# Altium project bms.PrjPcb
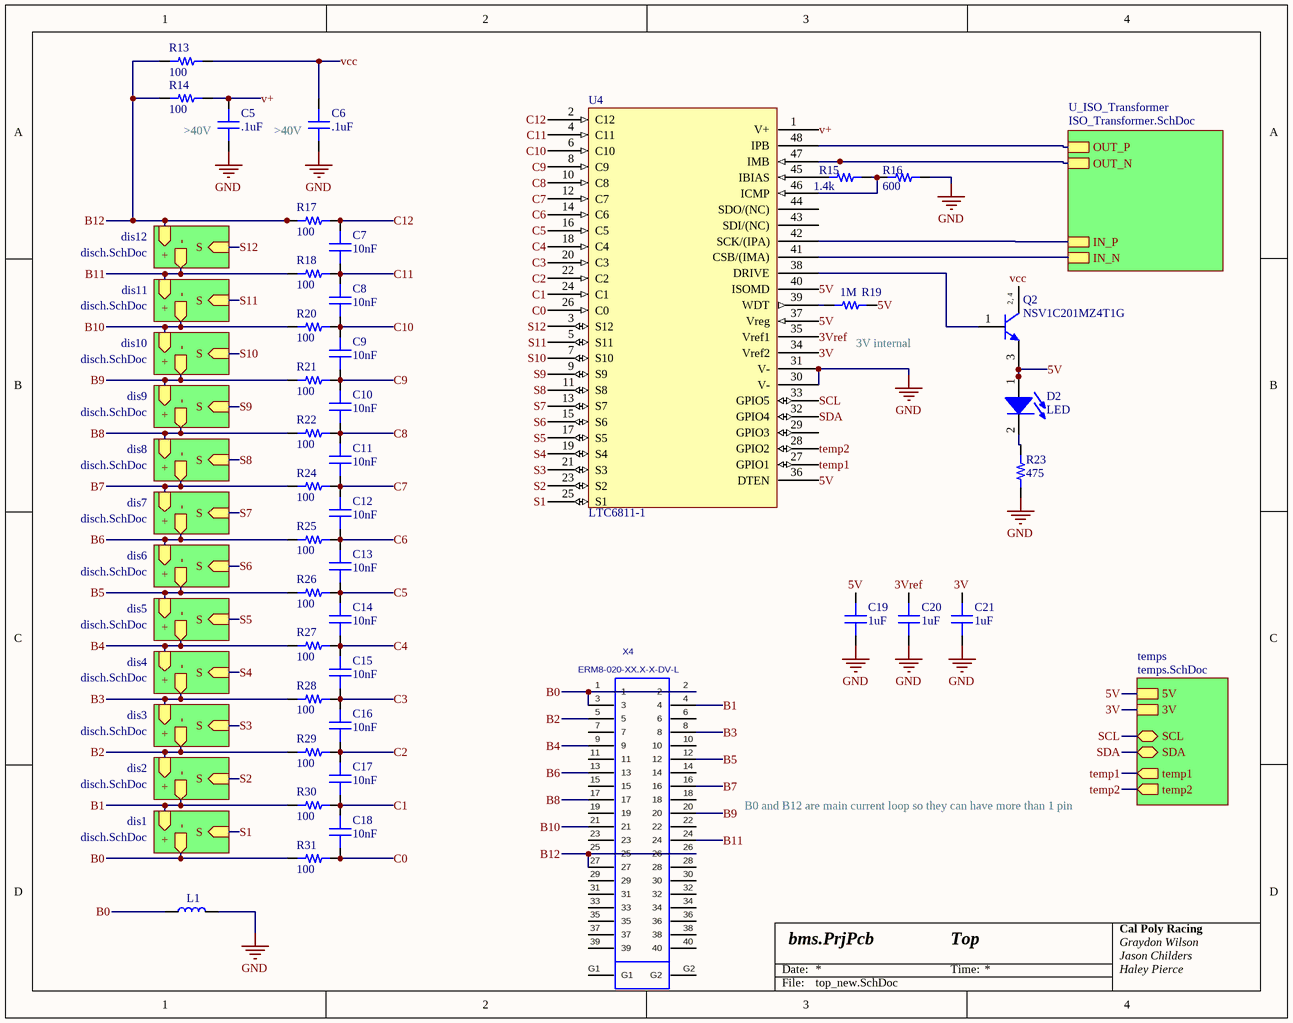
[diagram p0: top_new.SchDoc]
4 sheets, 122 parts. Net scope: hierarchical (ports join the sheet entries above them; power ports are global).
Board file: BMS.PcbDoc
Sheets:
  top_new.SchDoc
    dis1 = disch.SchDoc
    dis2 = disch.SchDoc
    dis3 = disch.SchDoc
    dis4 = disch.SchDoc
    dis5 = disch.SchDoc
    dis6 = disch.SchDoc
    dis7 = disch.SchDoc
    dis8 = disch.SchDoc
    dis9 = disch.SchDoc
    dis10 = disch.SchDoc
    dis11 = disch.SchDoc
    dis12 = disch.SchDoc
    U_ISO_Transformer = ISO_Transformer.SchDoc
    temps = temps.SchDoc

## Sheet top_new.SchDoc: Top
size A; Organization: Cal Poly Racing; engineer1: Graydon Wilson; engineer2: Jason Childers; engineer3: Haley Pierce

### Parts
(Parts that share a designator on the sheet are numbered #1, #2 ... from top to bottom, then left to right.)
C5  capacitance: .1uF  [0603]  (hidden comment: capacitor)
C6  capacitance: .1uF  [0603]  (hidden comment: capacitor)
C7  capacitance: 10nF  [0603]  (hidden comment: capacitor)
C8  capacitance: 10nF  [0603]  (hidden comment: capacitor)
C9  capacitance: 10nF  [0603]  (hidden comment: capacitor)
C10  capacitance: 10nF  [0603]  (hidden comment: capacitor)
C11  capacitance: 10nF  [0603]  (hidden comment: capacitor)
C12  capacitance: 10nF  [0603]  (hidden comment: capacitor)
C13  capacitance: 10nF  [0603]  (hidden comment: capacitor)
C14  capacitance: 10nF  [0603]  (hidden comment: capacitor)
C15  capacitance: 10nF  [0603]  (hidden comment: capacitor)
C16  capacitance: 10nF  [0603]  (hidden comment: capacitor)
C17  capacitance: 10nF  [0603]  (hidden comment: capacitor)
C18  capacitance: 10nF  [0603]  (hidden comment: capacitor)
C19  capacitance: 1uF  [0603]  (hidden comment: capacitor)
C20  capacitance: 1uF  [0603]  (hidden comment: capacitor)
C21  capacitance: 1uF  [0603]  (hidden comment: capacitor)
D2#1  LED  [0805_LED]
L1  MPZ1608S221ATA00  [0603]  (value not drawn)
Q2#1  NSV1C201MZ4T1G  [ONSC-SOT-223-4-318E-04_V]
R13  100  [RES 0805/2012]
R14  100  [RES 0805/2012]
R15#1  1.4k  [RES 0603/1608]
R16  600  [RES 0603/1608]
R17#1  100  [RES 0603/1608]
R18  100  [RES 0603/1608]
R19#1  1M  [RES 0603/1608]
R20  100  [RES 0603/1608]
R21#1  100  [RES 0603/1608]
R22  100  [RES 0603/1608]
R23#1  475  [RES 0805/2012]
R24  100  [RES 0603/1608]
R25#1  100  [RES 0603/1608]
R26  100  [RES 0603/1608]
R27#1  100  [RES 0603/1608]
R28  100  [RES 0603/1608]
R29#1  100  [RES 0603/1608]
R30  100  [RES 0603/1608]
R31#1  100  [RES 0603/1608]
U4  LTC6811-1  [LTC6811-1]
X4  ERM8-020-XX.X-X-DV-L  [ERM8-020-XX.X-X-DV-L]

### Sub-sheets
dis1 = disch.SchDoc: - (out), + (in), S (in)
dis2 = disch.SchDoc: - (out), + (in), S (in)
dis3 = disch.SchDoc: - (out), + (in), S (in)
dis4 = disch.SchDoc: - (out), + (in), S (in)
dis5 = disch.SchDoc: - (out), + (in), S (in)
dis6 = disch.SchDoc: - (out), + (in), S (in)
dis7 = disch.SchDoc: - (out), + (in), S (in)
dis8 = disch.SchDoc: - (out), + (in), S (in)
dis9 = disch.SchDoc: - (out), + (in), S (in)
dis10 = disch.SchDoc: - (out), + (in), S (in)
dis11 = disch.SchDoc: - (out), + (in), S (in)
dis12 = disch.SchDoc: - (out), + (in), S (in)
temps = temps.SchDoc: 5V, SCL (bidir), SDA (bidir), temp1 (out), temp2 (out), 3V
U_ISO_Transformer = ISO_Transformer.SchDoc: OUT_P, OUT_N, IN_P, IN_N

### Nets
GND: C5.1 C6.1 C19.1 C20.1 C21.1 L1.2 R16.2 R23#1.1 U4.30(V-) U4.31(V-)
3V: C21.2 U4.34(Vref2) ; sheet temps/3V
3Vref: C20.2 U4.35(Vref1)
5V: C19.2 D2#1.1(A) Q2#1.3(E) R19#1.2 U4.36(DTEN) U4.37(Vreg) U4.40(ISOMD) ; sheet temps/5V
B0: L1.1 R31#1.1 X4.1 X4.2 X4.3 ; sheet dis1/-
B1: R30.1 X4.4 ; sheet dis1/+, sheet dis2/-
B2: R29#1.1 X4.5 ; sheet dis2/+, sheet dis3/-
B3: R28.1 X4.8 ; sheet dis3/+, sheet dis4/-
B4: R27#1.1 X4.9 ; sheet dis4/+, sheet dis5/-
B5: R26.1 X4.12 ; sheet dis5/+, sheet dis6/-
B6: R25#1.1 X4.13 ; sheet dis6/+, sheet dis7/-
B7: R24.1 X4.16 ; sheet dis7/+, sheet dis8/-
B8: R22.1 X4.17 ; sheet dis8/+, sheet dis9/-
B9: R21#1.1 X4.20 ; sheet dis9/+, sheet dis10/-
B10: R20.1 X4.21 ; sheet dis10/+, sheet dis11/-
B11: R18.1 X4.24 ; sheet dis11/+, sheet dis12/-
B12: R13.1 R14.1 R17#1.1 X4.25 X4.26 X4.27 ; sheet dis12/+
C0: C18.1 R31#1.2 U4.26(C0)
C1: C17.1 C18.2 R30.2 U4.24(C1)
C2: C16.1 C17.2 R29#1.2 U4.22(C2)
C3: C15.1 C16.2 R28.2 U4.20(C3)
C4: C14.1 C15.2 R27#1.2 U4.18(C4)
C5: C13.1 C14.2 R26.2 U4.16(C5)
C6: C12.1 C13.2 R25#1.2 U4.14(C6)
C7: C11.1 C12.2 R24.2 U4.12(C7)
C8: C10.1 C11.2 R22.2 U4.10(C8)
C9: C9.1 C10.2 R21#1.2 U4.8(C9)
C10: C8.1 C9.2 R20.2 U4.6(C10)
C11: C7.1 C8.2 R18.2 U4.4(C11)
C12: C7.2 R17#1.2 U4.2(C12)
S1: U4.25(S1) ; sheet dis1/S
S2: U4.23(S2) ; sheet dis2/S
S3: U4.21(S3) ; sheet dis3/S
S4: U4.19(S4) ; sheet dis4/S
S5: U4.17(S5) ; sheet dis5/S
S6: U4.15(S6) ; sheet dis6/S
S7: U4.13(S7) ; sheet dis7/S
S8: U4.11(S8) ; sheet dis8/S
S9: U4.9(S9) ; sheet dis9/S
S10: U4.7(S10) ; sheet dis10/S
S11: U4.5(S11) ; sheet dis11/S
S12: U4.3(S12) ; sheet dis12/S
SCL: U4.33(GPIO5) ; sheet temps/SCL
SDA: U4.32(GPIO4) ; sheet temps/SDA
temp1: U4.27(GPIO1) ; sheet temps/temp1
temp2: U4.28(GPIO2) ; sheet temps/temp2
v+: C5.2 R14.2 U4.1(V+)
vcc: C6.2 Q2#1.2(C) Q2#1.4(C) R13.2
NetD2#1_2: D2#1.2(K) R23#1.2
NetQ2#1_1: Q2#1.1(B) U4.38(DRIVE)
NetR1#2_2: U4.48(IPB) ; sheet U_ISO_Transformer/OUT_P
NetR2#2_1: U4.47(IMB) ; sheet U_ISO_Transformer/OUT_N
NetR3#2_2: U4.42(SCK/(IPA)) ; sheet U_ISO_Transformer/IN_P
NetR4#2_1: U4.41(CSB/(IMA)) ; sheet U_ISO_Transformer/IN_N
NetR15#1_1: R15#1.1 U4.45(IBIAS)
NetR15#1_2: R15#1.2 R16.1 U4.46(ICMP)
NetR19#1_1: R19#1.1 U4.39(WDT)

Not connected (* = marked no-connect by the designer): U4 29(GPIO3) 43(SDI/(NC)) 44(SDO/(NC)); X4 6 7 10 11 14 15 18 19 22 23 28 29 30 31 32 33 34 35 36 37 38 39 40 G1 G2

### Notes on the sheet
- >40V
- (near C6) >40V
- (near R19#1) 3V internal
- B0 and B12 are main current loop so they can have more than 1 pin
- Date:
- Time:
- File:
- (in symbol CMP-1048-00450-1) 2, 4

### Library data of the parts
C5-C21 = 1: Generic 0603 capacitor; id: 1; voltage: 50; dielectric: Ceramic; percent tolerance: 10; name: 0603 Capacitor; ESR: 1; package: 0603; quantity: 0
D2#1 = 19: Generic 0805 LED; id: 19; vr: 1; name: 0805 LED; numcircuits: 1; package: 0805; quantity: 0
L1 = 10: 220 Ohms @ 100MHz 1 Power Line Ferrite Bead 0; MF: TDK; id: 10; imax: 2.20000004768372; tolerance: 0; resistance: 50mOhm; MP: MPZ1608S221ATA00; SnapEDA_Link: https://www.snapeda.com/parts/MPZ1608S221ATA00/TDK-Lambda%20Americas%20Inc/view-part/?ref=snap; Digi-Key_Part_Number: 445-1565-1-ND; Digi-Key_Purchase_URL: https://www.digikey.com/product-detail/en/tdk-corporation/MPZ1608S221ATA00/445-1565-1-ND/571895?utm_source=snapeda&utm_medium=aggregator&utm_campaign=symbol; Package: 0603; Value: *; name: MPZ1608S221ATA00; quantity: 0; link: https://www.digikey.com/product-detail/en/tdk-corporation/MPZ1608S221ATA00/445-1565-1-ND/571895; createdby: Kevin
Q2#1 = CMP-1048-00450-1: 100 V, 2 A, Low VCE(sat), NPN Transistor, 4-Pin SOT-223, Pb-Free, Tape and Reel; Manufacturer: On Semiconductor; IC Continuous (A): 2; Note1: 0; PackageReference: SOT-223-4-318E-04; Polarity: NPN; ComponentLink3URL: http://www.onsemi.com/pub_link/Collateral/318E-04.PDF; RoHS: TRUE; PackageDescription: 4-Pin Small Outline Transistor, Body 6.5 x 3.5 mm, Pitch 2.3 mm; DatasheetVersion: Rev. 4; Mounting Technology: Surface Mount; ComponentLink1Description: Manufacturer URL; ComponentLink1URL: http://www.onsemi.com/; PackageVersion: Rev. N, 08/2009; ComponentLink2Description: Datasheet; Packing: Tape and Reel; ComponentLink2URL: http://www.onsemi.cn/pub_link/Collateral/NSS1C201MZ4-D.PDF; ComponentLink3Description: Package Specification; PartNumber: NSV1C201MZ4T1G
R13 R14 R23#1 = 2: id: 2; name: 0805 Resistor; percent tolerance: 5; package: 0805; quantity: 0; createdby: Kevin
  R13 R14: resistance: 100
  R23: resistance: 475
R15#1 R16 R17#1 R18 R19#1 R20 R21#1 R22 R24 R25#1 R26 R27#1 R28 R29#1 R30 R31#1 = 1: id: 1; name: 0603 Resistor; percent tolerance: 5; package: 0603; quantity: 0
  R15: resistance: 1.4k
  R16: resistance: 600
  R17 R18 R20-R22 R24-R31: resistance: 100
  R19: resistance: 1M
U4 = 37: id: 37; vcc: 40; voltageinmax: 55; name: LTC6811-1; package: SSOP; quantity: 0; link: https://www.analog.com/media/en/technical-documentation/data-sheets/68111fb.pdf
X4 = 34: MANUFACTURER: SAMTEC; id: 34; numcontacts: 40; numrows: 2; CREATED: August 17, 2016 - Wendy Xin; PCB DECAL: ERM8-020-XX.X-X-DV-L; name: ERM8-020-XX.X-X-DV-L; quantity: 0

## Sheet disch.SchDoc: Discharge
size A; Organization: Cal Poly Racing; engineer1: Graydon Wilson; engineer2: Jason Childers; engineer3: Haley Pierce
Used 12 times, as channels dis1, dis2, dis3, dis4, dis5, dis6, dis7, dis8, dis9, dis10, dis11, dis12. Parts and nets are listed once, with the designators drawn on the sheet.
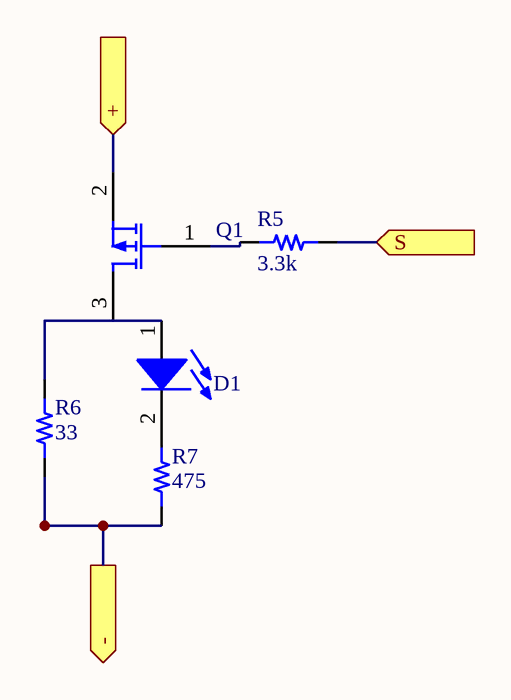
[diagram p1: disch.SchDoc]

### Parts
D1  LED  [0805_LED]  (value not drawn)
Q1  CMUDM8005 TR PFET  [CMUDM8005 TR SOT523]  (value not drawn)
R5  3.3k  [RES 0603/1608]
R6  33  [RES 2512/6332]
R7  475  [RES 0603/1608]

### Ports
+ (in), - (out), S (in)

### Nets
+: Q1.2(S) ; port +
-: R6.2 R7.2 ; port -
S: R5.2 ; port S
NetD1_1: D1.1(A) Q1.3(D) R6.1
NetD1_2: D1.2(K) R7.1
NetQ1_1: Q1.1(G) R5.1

### Channels
dis1: designators D1=D1 Q1=Q1 R5=R15#2 R6=R53 R7=R1#1; ports +=B1 -=B0 S=S1
dis2: designators D1=D2#2 Q1=Q2#2 R5=R17#2 R6=R54 R7=R2#1; ports +=B2 -=B1 S=S2
dis3: designators D1=D3 Q1=Q3 R5=R19#2 R6=R55 R7=R3#1; ports +=B3 -=B2 S=S3
dis4: designators D1=D4 Q1=Q4 R5=R21#2 R6=R56 R7=R4#1; ports +=B4 -=B3 S=S4
dis5: designators D1=D5 Q1=Q5 R5=R23#2 R6=R57 R7=R5; ports +=B5 -=B4 S=S5
dis6: designators D1=D6 Q1=Q6 R5=R25#2 R6=R58 R7=R6; ports +=B6 -=B5 S=S6
dis7: designators D1=D7 Q1=Q7 R5=R27#2 R6=R59 R7=R7; ports +=B7 -=B6 S=S7
dis8: designators D1=D8 Q1=Q8 R5=R29#2 R6=R60 R7=R8#1; ports +=B8 -=B7 S=S8
dis9: designators D1=D9 Q1=Q9 R5=R31#2 R6=R61 R7=R9#1; ports +=B9 -=B8 S=S9
dis10: designators D1=D10 Q1=Q10 R5=R33 R6=R62 R7=R10#1; ports +=B10 -=B9 S=S10
dis11: designators D1=D11 Q1=Q11 R5=R35 R6=R63 R7=R11#1; ports +=B11 -=B10 S=S11
dis12: designators D1=D12 Q1=Q12 R5=R36 R6=R64 R7=R12#1; ports +=B12 -=B11 S=S12

### Notes on the sheet
- Date:
- Time:
- File:

### Library data of the parts
D1 = 19: Generic 0805 LED; id: 19; vr: 1; name: 0805 LED; numcircuits: 1; package: 0805; quantity: 0
Q1 = 13: MOSFET P-CH 20V 650MA SOT523; id: 13; type: P_Channel; vdsmax: 0; numcircuits: 1; rdson: 360m; vgsmax: 8; name: CMUDM8005 TR PFET; current: 650mA; package: SOT-523; quantity: 0; link: https://www.digikey.com/product-detail/en/central-semiconductor-corp/CMUDM8005-TR/CMUDM8005CT-ND/5324590
R5 R7 = 1: as R15#1 on sheet top_new; package: 0603; quantity: 0
  R5: resistance: 3.3k
  R7: resistance: 475
R6 = 4: id: 4; name: 2512 Resistor; percent tolerance: 5; resistance: 33; package: 2512; quantity: 0; createdby: Kevin

## Sheet ISO_Transformer.SchDoc: Isolation
size A; Organization: Cal Poly Racing; engineer1: Graydon Wilson; engineer2: Jason Childers; engineer3: Haley Pierce
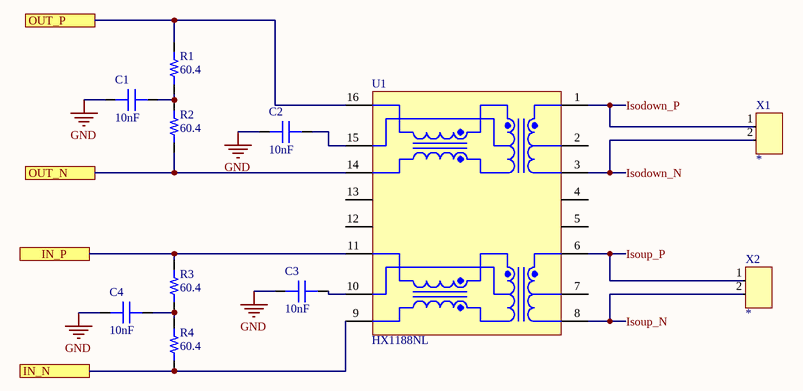
[diagram p2: ISO_Transformer.SchDoc]

### Parts
(Parts that share a designator on the sheet are numbered #1, #2 ... from top to bottom, then left to right.)
C1  capacitance: 10nF  [0603]  (hidden comment: capacitor)
C2  capacitance: 10nF  [0603]  (hidden comment: capacitor)
C3  capacitance: 10nF  [0603]  (hidden comment: capacitor)
C4  capacitance: 10nF  [0603]  (hidden comment: capacitor)
R1#2  60.4  [RES 0603/1608]
R2#2  60.4  [RES 0603/1608]
R3#2  60.4  [RES 0603/1608]
R4#2  60.4  [RES 0603/1608]
U1  HX1188NL  [PULS-MODULE-16_V]
X1  *  [CONN 43650-0200 MOLEX 2PIN]
X2  *  [CONN 43650-0200 MOLEX 2PIN]

### Ports
IN_N, IN_P, OUT_N, OUT_P

### Nets
GND: C1.1 C2.1 C3.1 C4.1
Isodown_N: U1.3 X1.2
Isodown_P: U1.1 X1.1
Isoup_N: U1.8 X2.2
Isoup_P: U1.6 X2.1
NetC1_2: C1.2 R1#2.1 R2#2.2
NetC2_2: C2.2 U1.15
NetC3_2: C3.2 U1.10
NetC4_2: C4.2 R3#2.1 R4#2.2
NetR1#2_2: R1#2.2 U1.16 ; port OUT_P
NetR2#2_1: R2#2.1 U1.14 ; port OUT_N
NetR3#2_2: R3#2.2 U1.11 ; port IN_P
NetR4#2_1: R4#2.1 U1.9 ; port IN_N

Not connected (* = marked no-connect by the designer): U1 2 4 5 7 12 13

### Notes on the sheet
- Date:
- Time:
- File:

### Library data of the parts
C1-C4 = 1: as C5 on sheet top_new; name: 0603 Capacitor; ESR: 1; package: 0603; quantity: 0
R1#2 R2#2 R3#2 R4#2 = 1: as R15#1 on sheet top_new; resistance: 60.4; package: 0603; quantity: 0
U1 = CMP-2000-05323-1: 10/100 Base-T Single Port Surface Mount Magnetic with Turns Ratio, -40 to 85 degC, 16-Pin Module, RoHS, Tube; Manufacturer: Pulse Electronics; Other Related Documents: PackagesFNLvs.NL; Other Names: 553-1340; PCN Design/Specification: ThermoplasticHeaderDesign28/Jun/2013; Transformer Type: IsolationandDataInterface(Encapsulated); PCN Other: HaloInjunctionRes1/Sep/2015; Turns Ratio - Primary: Secondary:1:1Transmitter,1:1Receiver; Family: PulseTransformers; Datasheet URL: https://datasheet.ciiva.com/26929/hx1188nl-26929858.pdf; Mounting Type: SurfaceMount; Size / Dimension: 12.70mmLx7.11mmW; Inductance: -; Package Description: 16-Pin Surface Mount Device, Body 12.7 x 7.11 mm, Pitch 1.27 mm; Height - Seated (Max): 6.22mm; E.T.: -; Online Catalog: 10/100BASE-TSinglePort; Manufacturer URL: http://www.pulseelectronics.com/; Package Reference: MODULE-16; Series: -; Category: Transformers; Standard Package: 40; Datasheet Version: Rev. H325.Q, 09/2009
X1 X2 = 9: Molex 43650_0200; id: 9; name: 0436500200; numcontacts: 2; numrows: 1; pitch: 3 mm; MfrPartNo: *; quantity: 0; link: https://www.digikey.com/product-detail/en/molex-llc/0436500200/WM1860-ND/268989

## Sheet temps.SchDoc: Temperatures
size A; Organization: Cal Poly Racing; engineer1: Graydon Wilson; engineer2: Jason Childers; engineer3: Haley Pierce
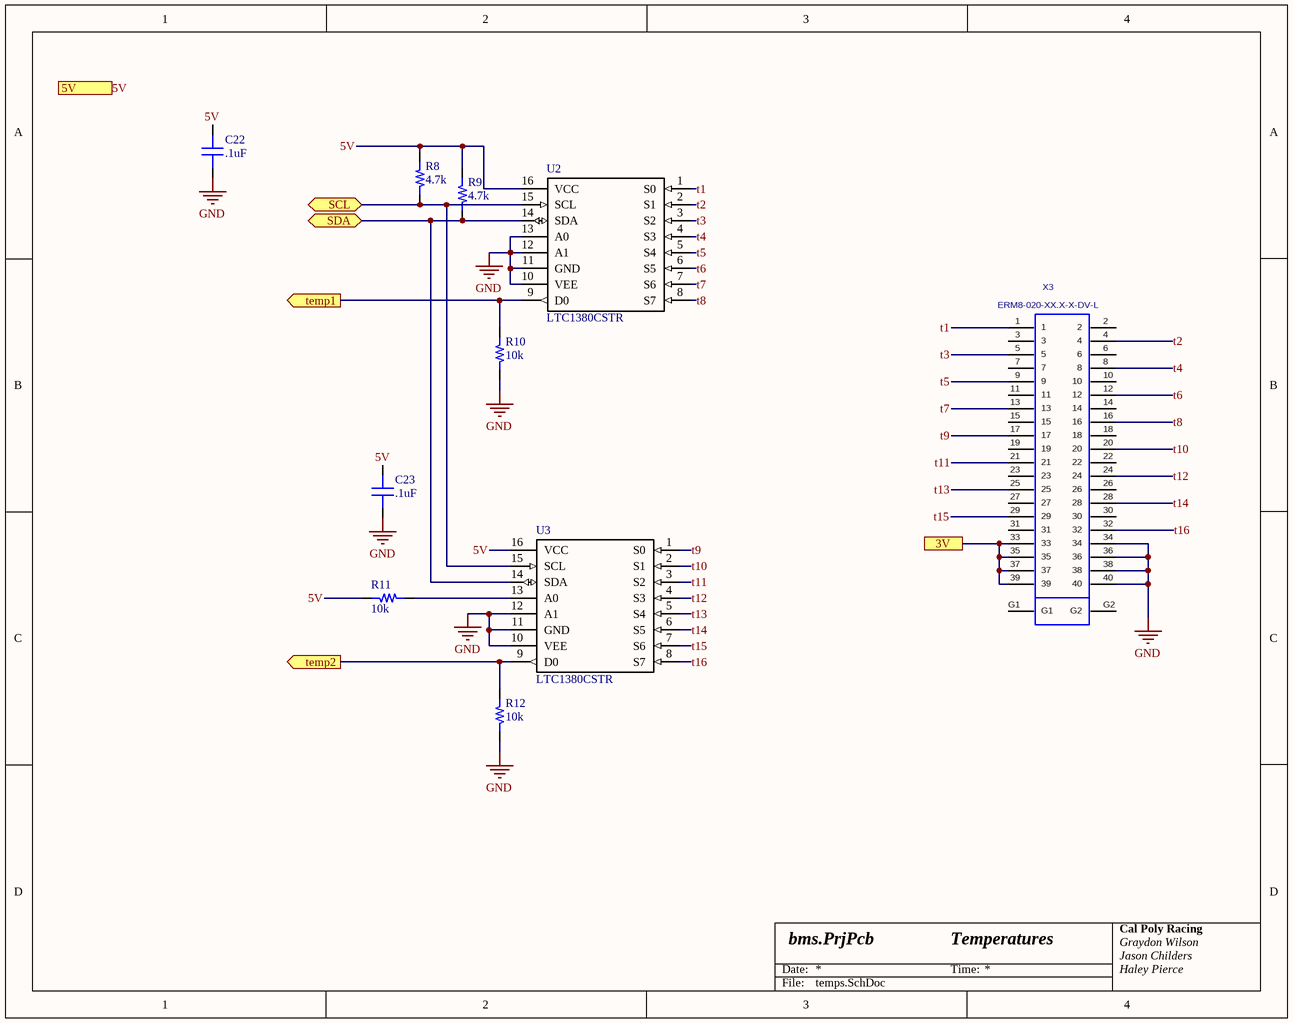
[diagram p3: temps.SchDoc]

### Parts
(Parts that share a designator on the sheet are numbered #1, #2 ... from top to bottom, then left to right.)
C22  capacitance: .1uF  [0603]  (hidden comment: capacitor)
C23  capacitance: .1uF  [0603]  (hidden comment: capacitor)
R8#2  4.7k  [RES 0603/1608]
R9#2  4.7k  [RES 0603/1608]
R10#2  10k  [RES 0603/1608]
R11#2  10k  [RES 0603/1608]
R12#2  10k  [RES 0603/1608]
U2  LTC1380CSTR  [LTC1380CSTR]
U3  LTC1380CSTR  [LTC1380CSTR]
X3  ERM8-020-XX.X-X-DV-L  [ERM8-020-XX.X-X-DV-L]

### Ports
3V, 5V, SCL (bidir), SDA (bidir), temp1 (out), temp2 (out)

### Nets
GND: C22.1 C23.1 R10#2.1 R12#2.1 U2.10(VEE) U2.11(GND) U2.12(A1) U2.13(A0) U3.10(VEE) U3.11(GND) U3.12(A1) X3.34 X3.36 X3.38 X3.40
3V: X3.33 X3.35 X3.37 X3.39 ; port 3V
5V: C22.2 C23.2 R8#2.2 R9#2.2 R11#2.2 U2.16(VCC) U3.16(VCC) ; port 5V
SCL: R8#2.1 U2.15(SCL) U3.15(SCL) ; port SCL
SDA: R9#2.1 U2.14(SDA) U3.14(SDA) ; port SDA
t1: U2.1(S0) X3.1
t2: U2.2(S1) X3.4
t3: U2.3(S2) X3.5
t4: U2.4(S3) X3.8
t5: U2.5(S4) X3.9
t6: U2.6(S5) X3.12
t7: U2.7(S6) X3.13
t8: U2.8(S7) X3.16
t9: U3.1(S0) X3.17
t10: U3.2(S1) X3.20
t11: U3.3(S2) X3.21
t12: U3.4(S3) X3.24
t13: U3.5(S4) X3.25
t14: U3.6(S5) X3.28
t15: U3.7(S6) X3.29
t16: U3.8(S7) X3.32
temp1: R10#2.2 U2.9(D0) ; port temp1
temp2: R12#2.2 U3.9(D0) ; port temp2
NetR11#2_1: R11#2.1 U3.13(A0)

Not connected (* = marked no-connect by the designer): X3 2 3 6 7 10 11 14 15 18 19 22 23 26 27 30 31 G1 G2

### Notes on the sheet
- Date:
- Time:
- File:

### Library data of the parts
C22 C23 = 1: as C5 on sheet top_new; name: 0603 Capacitor; ESR: 1; package: 0603; quantity: 0
R8#2 R9#2 R10#2 R11#2 R12#2 = 1: as R15#1 on sheet top_new; package: 0603; quantity: 0
  R8 R9: resistance: 4.7k
  R10-R12: resistance: 10k
U2 U3 = 39: 8:1 analog multiplexer. I2C interface. 2 address pins.; id: 39; vcc: 5; updatedby: 0; name: LTC1380; voltageinmax: 5; package: SOIC-16; quantity: 0; link: https://www.mouser.com/ProductDetail/Analog-Devices-Linear-Technology/LTC1380CSTR?qs=hVkxg5c3xu%2Flgahs8%252BvvEA%3D%3D; createdby: Haley Pierce
X3 = 34: as X4 on sheet top_new; CREATED: August 17, 2016 - Wendy Xin; PCB DECAL: ERM8-020-XX.X-X-DV-L; name: ERM8-020-XX.X-X-DV-L; quantity: 0

## Nets that join several sheets
GND: top_new (10 pins), ISO_Transformer (C1.1 C2.1 C3.1 C4.1), temps (15 pins)
3V: top_new (C21.2 U4.34), temps (X3.33 X3.35 X3.37 X3.39)
5V: top_new (7 pins), temps (7 pins)
B0: top_new (5 pins), dis1 (R1#1.2 R53.2)
B1: top_new (R30.1 X4.4), dis1 (Q1.2), dis2 (R2#1.2 R54.2)
B2: top_new (R29#1.1 X4.5), dis2 (Q2#2.2), dis3 (R3#1.2 R55.2)
B3: top_new (R28.1 X4.8), dis3 (Q3.2), dis4 (R4#1.2 R56.2)
B4: top_new (R27#1.1 X4.9), dis4 (Q4.2), dis5 (R5.2 R57.2)
B5: top_new (R26.1 X4.12), dis5 (Q5.2), dis6 (R6.2 R58.2)
B6: top_new (R25#1.1 X4.13), dis6 (Q6.2), dis7 (R7.2 R59.2)
B7: top_new (R24.1 X4.16), dis7 (Q7.2), dis8 (R8#1.2 R60.2)
B8: top_new (R22.1 X4.17), dis8 (Q8.2), dis9 (R9#1.2 R61.2)
B9: top_new (R21#1.1 X4.20), dis9 (Q9.2), dis10 (R10#1.2 R62.2)
B10: top_new (R20.1 X4.21), dis10 (Q10.2), dis11 (R11#1.2 R63.2)
B11: top_new (R18.1 X4.24), dis11 (Q11.2), dis12 (R12#1.2 R64.2)
B12: top_new (6 pins), dis12 (Q12.2)
NetR1#2_2: top_new (U4.48), ISO_Transformer (R1#2.2 U1.16)
NetR2#2_1: top_new (U4.47), ISO_Transformer (R2#2.1 U1.14)
NetR3#2_2: top_new (U4.42), ISO_Transformer (R3#2.2 U1.11)
NetR4#2_1: top_new (U4.41), ISO_Transformer (R4#2.1 U1.9)
S1: top_new (U4.25), dis1 (R15#2.2)
S2: top_new (U4.23), dis2 (R17#2.2)
S3: top_new (U4.21), dis3 (R19#2.2)
S4: top_new (U4.19), dis4 (R21#2.2)
S5: top_new (U4.17), dis5 (R23#2.2)
S6: top_new (U4.15), dis6 (R25#2.2)
S7: top_new (U4.13), dis7 (R27#2.2)
S8: top_new (U4.11), dis8 (R29#2.2)
S9: top_new (U4.9), dis9 (R31#2.2)
S10: top_new (U4.7), dis10 (R33.2)
S11: top_new (U4.5), dis11 (R35.2)
S12: top_new (U4.3), dis12 (R36.2)
SCL: top_new (U4.33), temps (R8#2.1 U2.15 U3.15)
SDA: top_new (U4.32), temps (R9#2.1 U2.14 U3.14)
temp1: top_new (U4.27), temps (R10#2.2 U2.9)
temp2: top_new (U4.28), temps (R12#2.2 U3.9)